# EAGLE schematic lightfollower (EAGLE 7.1.0)
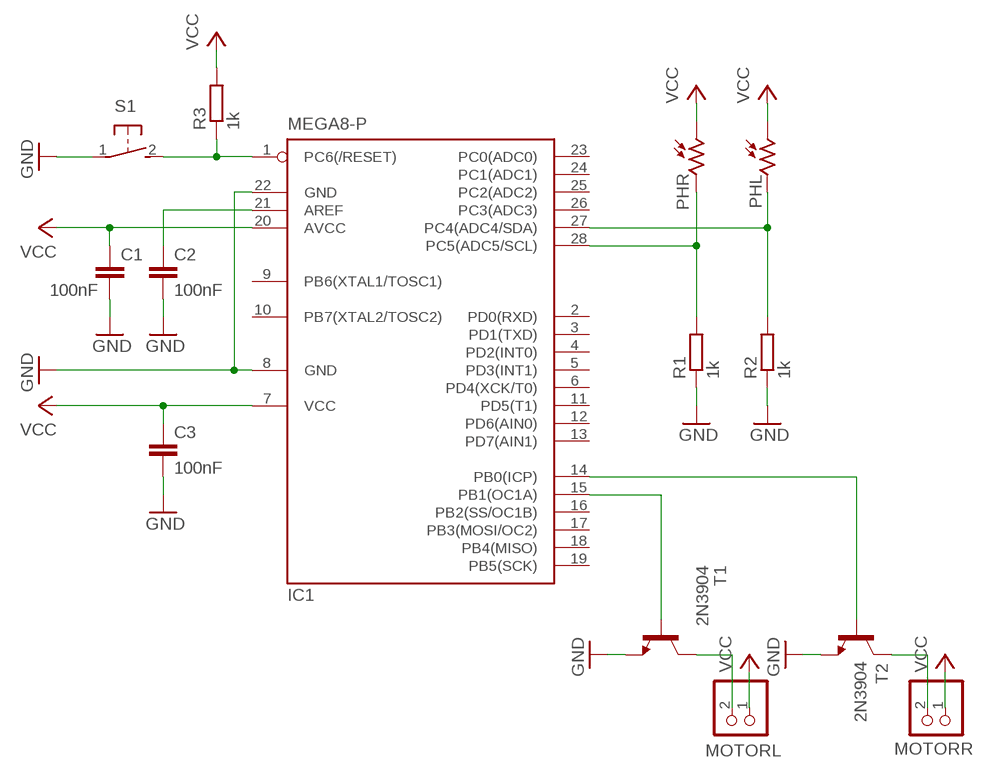
[diagram p0: schematic, sheet 1]

## Parts
C1  100nF  C-EUC0805  [C0805]
C2  100nF  C-EUC0805  [C0805]
C3  100nF  C-EUC0805  [C0805]
IC1  MEGA8-P  [DIL28-3]
MOTORL  PINHD-1X2  [1X02]
MOTORR  PINHD-1X2  [1X02]
PHL  D1160_12  [D11XX]
PHR  D1160_12  [D11XX]
R1  1k  R-EU_0204/5  [0204/5]
R2  1k  R-EU_0204/5  [0204/5]
R3  1k  R-EU_0204/5  [0204/5]
S1  DTS-3  [DTS-3]
T1  2N3904  [TO92]
T2  2N3904  [TO92]

## Nets
GND: C1.2 C2.2 C3.2 IC1.8(GND) IC1.22(GND) R1.1 R2.1 S1.1 T1.3(E) T2.3(E)
N$1: IC1.28(PC5(ADC5/SCL)) PHR.2 R1.2
N$2: IC1.27(PC4(ADC4/SDA)) PHL.2 R2.2
N$3: IC1.15(PB1(OC1A)) T1.2(B)
N$4: MOTORL.2 T1.1(C)
N$6: IC1.14(PB0(ICP)) T2.2(B)
N$7: MOTORR.2 T2.1(C)
N$9: IC1.1(PC6(/RESET)) R3.1 S1.2
N$11: C2.1 IC1.21(AREF)
VCC: C1.1 C3.1 IC1.7(VCC) IC1.20(AVCC) MOTORL.1 MOTORR.1 PHL.1 PHR.1 R3.2
Unconnected: IC1.2(PD0(RXD)) IC1.3(PD1(TXD)) IC1.4(PD2(INT0)) IC1.5(PD3(INT1)) IC1.6(PD4(XCK/T0)) IC1.9(PB6(XTAL1/TOSC1)) IC1.10(PB7(XTAL2/TOSC2)) IC1.11(PD5(T1)) IC1.12(PD6(AIN0)) IC1.13(PD7(AIN1)) IC1.16(PB2(SS/OC1B)) IC1.17(PB3(MOSI/OC2)) IC1.18(PB4(MISO)) IC1.19(PB5(SCK)) IC1.23(PC0(ADC0)) IC1.24(PC1(ADC1)) IC1.25(PC2(ADC2)) IC1.26(PC3(ADC3))

## Library data of the parts
C1-C3 = rcl:C-EU: CAPACITOR, European symbol
IC1 = atmel:MEGA8-P: MICROCONTROLLER 8 Kbytes FLASH, 1 kbytes SRAM, 512 bytes EEPROM, USART, 4-channel 10 bit ADC, 2-channel 8 bit ADC Pin compatible with Atmega48, ATMega88, ATMega168 Source: avr.lbr; OC_FARNELL: unknown; OC_NEWARK: unknown
MOTORL MOTORR = pinhead:PINHD-1X2: PIN HEADER
PHL PHR = photo-elements:D11: Photo Sensor Oil Burner Control Applications Source: http://optoelectronics.perkinelmer.com/content/Datasheets/DTS_PhotocellsD1160.pdf
R1-R3 = rcl:R-EU_: RESISTOR, European symbol
S1 = switch-tact:DTS-3
T1 T2 = transistor:2N3904: NPN TRANSISTOR